# Altium schematic sheet Power_System.SchDoc
size A3; SheetNumber: 3; SheetTotal: 5
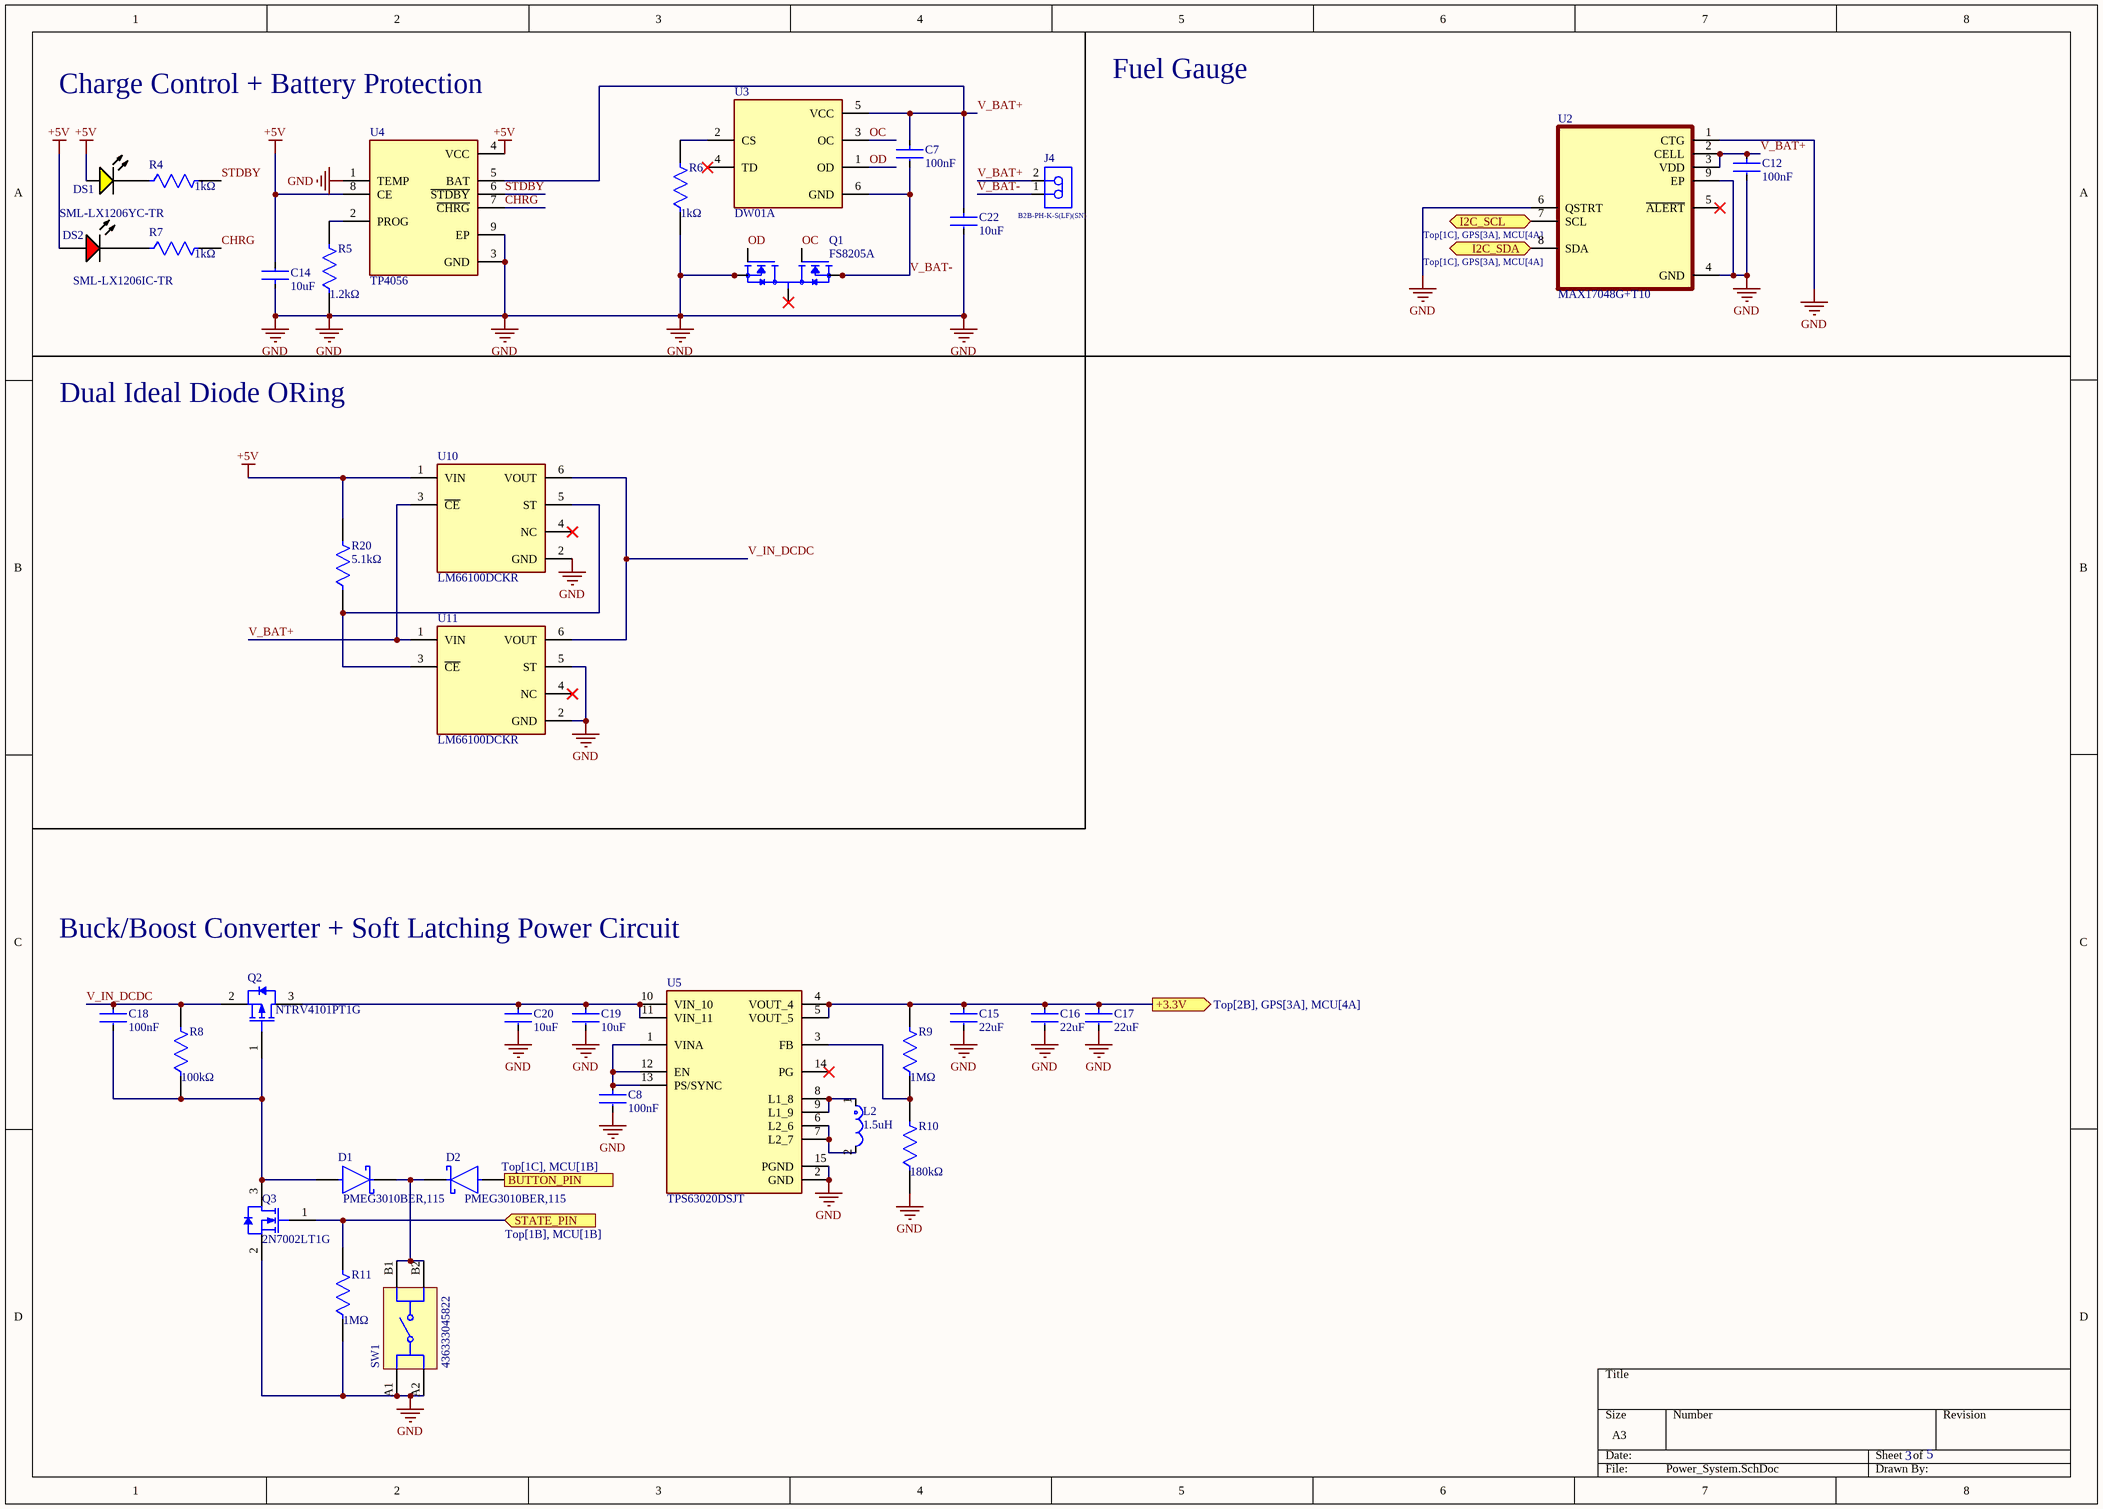
[diagram p0: Power_System.SchDoc]

## Parts
C7  100nF  [0402_CAPACITOR]
C8  100nF  [0402_CAPACITOR]
C12  100nF  [0603_CAPACITOR]
C14  10uF  [0402_CAPACITOR]
C15  22uF  [0603_CAPACITOR]
C16  22uF  [0603_CAPACITOR]
C17  22uF  [0603_CAPACITOR]
C18  100nF  [0603_CAPACITOR]
C19  10uF  [0603_CAPACITOR]
C20  10uF  [0603_CAPACITOR]
C22  10uF  [0402_CAPACITOR]
D1  PMEG3010BER,115  [SHOTTKY]
D2  PMEG3010BER,115  [SHOTTKY]
DS1  SML-LX1206YC-TR  [YELLOW_LED_1206]
DS2  SML-LX1206IC-TR  [RED_LED_1206]
J4  B2B-PH-K-S(LF)(SN)  [JST-B2B-PH-K-S_V]
L2  1.5uH  [1.5uH]
Q1  FS8205A  [SOP65P640X120-8N]
Q2  NTRV4101PT1G  [P_CHANNEL_MOSFET]
Q3  2N7002LT1G  [N_CHANNEL_MOSFET]
R4  value 1kΩ  [0402_RESISTOR]  (hidden comment: RESISTOR)
R5  value 1.2kΩ  [0402_RESISTOR]  (hidden comment: RESISTOR)
R6  value 1kΩ  [0402_RESISTOR]  (hidden comment: RESISTOR)
R7  value 1kΩ  [0402_RESISTOR]  (hidden comment: RESISTOR)
R8  value 100kΩ  [0603_RESISTOR]  (hidden comment: RESISTOR)
R9  value 1MΩ  [0603_RESISTOR]  (hidden comment: RESISTOR)
R10  value 180kΩ  [0603_RESISTOR]  (hidden comment: RESISTOR)
R11  value 1MΩ  [0603_RESISTOR]  (hidden comment: RESISTOR)
R20  value 5.1kΩ  [0603_RESISTOR]
SW1  436333045822  [SIDE_BUTTON]
U2  MAX17048G+T10  [MAX17048]
U3  DW01A  [SOT95P280X145-6N]
U4  TP4056  [SOP127P600X175-9N]
U5  TPS63020DSJT  [IC_TPS63020DSJT]
U10  LM66100DCKR  [ideal_diode]
U11  LM66100DCKR  [ideal_diode]

## Ports
+3.3V (out, see Top[2B], GPS[3A], MCU[4A]), BUTTON_PIN (out, see Top[1C], MCU[1B]), I2C_SCL (bidir, see Top[1C], GPS[3A], MCU[4A]), I2C_SDA (bidir, see Top[1C], GPS[3A], MCU[4A]), STATE_PIN (in, see Top[1B], MCU[1B])

## Nets
+5V: C14.2 DS1.1(A) DS2.1(A) R20.2 U4.4(VCC) U4.8(CE) U10.1(VIN)
GND: C8.2 C12.2 C14.1 C15.2 C16.2 C17.2 C19.2 C20.2 C22.2 Q1.2(S1) Q1.3(S1) Q3.2(S) R5.1 R6.1 R10.1 R11.1 SW1.A1 SW1.A2 U2.1(CTG) U2.4(GND) U2.6(QSTRT) U2.9(EP) U4.1(TEMP) U4.3(GND) U4.9(EP) U5.2(GND) U5.15(PGND) U10.2(GND) U11.2(GND) U11.5(ST)
+3.3V: C15.1 C16.1 C17.1 R9.2 U5.4(VOUT_4) U5.5(VOUT_5) ; port +3.3V
BUTTON_PIN: D2.2(A) ; port BUTTON_PIN
CHRG: R7.2 U4.7(~{CHRG})
I2C_SCL: U2.7(SCL) ; port I2C_SCL
I2C_SDA: U2.8(SDA) ; port I2C_SDA
OC: Q1.5(G2) U3.3(OC)
OD: Q1.4(G1) U3.1(OD)
STATE_PIN: Q3.1(G) R11.2 ; port STATE_PIN
STDBY: R4.2 U4.6(~{STDBY})
V_BAT+: C7.1 C12.1 C22.1 J4.2 U2.2(CELL) U2.3(VDD) U3.5(VCC) U4.5(BAT) U10.3(~{CE}) U11.1(VIN)
V_BAT-: C7.2 J4.1 Q1.6(S2) Q1.7(S2) U3.6(GND)
V_IN_DCDC: C18.1 Q2.2(S) R8.2 U10.6(VOUT) U11.6(VOUT)
NetC8_1: C8.1 U5.1(VINA) U5.12(EN) U5.13(PS/SYNC)
NetC18_2: C18.2 D1.2(A) Q2.1(G) Q3.3(D) R8.1
NetC19_1: C19.1 C20.1 Q2.3(D) U5.10(VIN_10) U5.11(VIN_11)
NetD1_1: D1.1(K) D2.1(K) SW1.B1 SW1.B2
NetDS1_2: DS1.2(K) R4.1
NetDS2_2: DS2.2(K) R7.1
NetL2_1: L2.1 U5.8(L1_8) U5.9(L1_9)
NetL2_2: L2.2 U5.6(L2_6) U5.7(L2_7)
NetQ1_1: Q1.1(D12) Q1.8(D12)
NetR5_2: R5.2 U4.2(PROG)
NetR6_2: R6.2 U3.2(CS)
NetR9_1: R9.1 R10.2 U5.3(FB)
NetR20_1: R20.1 U10.5(ST) U11.3(~{CE})

Not connected (* = marked no-connect by the designer): U2 5(~{ALERT})*; U3 4(TD)*; U5 14(PG)*; U10 4(NC)*; U11 4(NC)*

## Notes on the sheet
- Charge Control + Battery Protection
- Fuel Gauge
- Dual Ideal Diode ORing
- Buck/Boost Converter + Soft Latching Power Circuit

## Library data of the parts
C7 C8 C12 C14-C20 C22 = CMP-001-00091-1: Design Item ID: CAPACITOR; Source: gps_project_schematic_library.SchLib
D1 D2 = SHOTTKY: DIODE SCHOTTKY 30V 1A SOD123W; Manufacturer: Nexperia; Automotive Grade: Grade 0; Max Surge Forward Current: 50A; Peak Reverse Current: 15uA; Max Junction Temp: +150°C; Capacitance: 170pF; Value: 170pF; ComponentLink2URL: https://assets.nexperia.com/documents/data-sheet/PMEG3010BER.pdf; Reverse Voltage: 30V; Forward Current: 1A; Ambient Temperature Range Low: -55°C; Ambient Temperature Range High: +150°C; Octopart: https://octopart.com/pmeg3010ber%2C115-nexperia-78741454; Package: SOD123W; Category: Diode; Lead Free: Yes; Digikey Description: DIODE SCHOTTKY 30V 1A SOD123W; Automotive: Yes; RoHS: TRUE; Height: 1.1mm; Temperature: to +150°C; Device Class L2: Diodes; ComponentLink2Description: Datasheet; Manufacturer Part Number: PMEG3010BER,115; Temperature Range High: +150°C; Device Class L3: Schottky Diodes; Device Class L1: Discrete Semiconductors; Footprint Url: https://assets.nexperia.com/documents/outline-drawing/SOD123W.pdf
DS1 = YELLOW_LED_1206: Yellow LED, Water Clear Len, 585 nm, 2.1 V, -40 to 85 degC, 2-Pin SMD, RoHS, Tape and Reel; Manufacturer: Lumex; Product Training Modules: LEDsBenefitsofCustomLEDandLCDTechnology; Millicandela Rating: 6mcd; Catalog Drawings: SML-LX1206SeriesTopSML-LX1206SeriesSideSML-LX1206SeriesBottomSML-LX1206SeriesFootprint; Wavelength - Peak: 585nm; Other Names: 67-1358-2LU60357TRSMLLX1206YCTR; Lens Style/Size: RectanglewithFlatTop; Current - Test: 20mA; Lens Color: Colorless; Viewing Angle: 160°; Voltage - Forward (Vf) (Typ): 2.1V; Online Catalog: SML-LX1206RectanglewithFlatTop1206PackageLEDs; Mounting Type: SurfaceMount; Package Description: 2-Pin Surface Mount Device, Body 3.2 x 1.5 mm; Datasheet Version: Rev. K, 08/2012; Features: -; Color: Yellow; RoHS Information: RoHSCertofCompliance; Package Reference: SML-LX1206YC-TR; Supplier Device Package: 1206; Standard Package: 3,000; Series: -; Wavelength - Dominant: -; Package / Case: 1206(3216Metric); Mounting Technology: SurfaceMount; Height (Max): 1.10mm; Lens Transparency: Clear; Datasheet URL: http://www.lumex.com/content/files/ProductAttachment/SML-LX1206YC-TR.pdf; Family: LEDIndication-Discrete; Manufacturer URL: http://www.lumexinstruments.com/; Packaging: Tape&Reel(TR); Category: Optoelectronics; Size / Dimension: 3.20mmLx1.60mmW
DS2 = LED_RED_1206: LED Red, 65 mW, -40 to 85 degC, 2-Pin SMD, RoHS, Tape and Reel; Manufacturer: Lumex; LED Material: GaAsP; Peak Wavelength: 635nm; Number of LEDs: 1; Viewing Angle: 160; Reverse Voltage: 5(Min)V; Lens Appearance: ColorlessNonDiffused; Intensity: 6mcd; Type: Uni-Color; Pin_Count: 2; Lens Dimensions: 2x1.6x0.5mm; Mounting: SurfaceMount; ECCN: EAR99; RoHS: Unknown; Package Description: 2-Pin Surface Mount Device, Body 3.2 x 1.5 mm; Mounting Technology: SurfaceMount; Dominant Wavelength: N/A; Supplier_Package: SMD; Supplier Standard Pack: 3,000; Color: Red; Dimension: 3.2x1.6x1.1mm; HTS: 8541402000; Part No: SML-LX1206IC-TR; Family: SML-LX1206IC; Supplier: Lumex; Datasheet URL: http://www.lumex.com/content/files/ProductAttachment/SML-LX1206IC-TR.pdf; Package Reference: SML-LX1206IC; Manufacturer URL: http://www.lumexinstruments.com/; Operating Temperature: -25to85C; Packaging: TapeandReel; Datasheet Version: Rev. J, 08/2012
J4 = JST CONNECTOR: Male Header, Pitch 2 mm, 1 x 2 Position, Height 6 mm, Tail Length 3.4 mm, -25 to 85 degC, RoHS, Bulk; Manufacturer: JST; Pitch: 2mm; Style/Orientation: StraightHeader/Plug; No of Positions: 2; Datasheet Version: Nov-08; Datasheet URL: http://datasheet.octopart.com/B2B-PH-K-S%28LF%29%28SN%29-JST-datasheet-8324864.pdf; Manufacturer URL: http://www.jst.com/home2.html; Type: ShroudedHeader; Termination: Crimp
L2 = 1.5uH: Inductor Power Shielded Wirewound 1.5uH 20% 100KHz 9.1A 15.8mOhm DCR 1515 Automotive Embossed Plastic T/R; Core Material: Composite; DC Resistance (DCR): 15.8mR; Saturation Current: 4.1A; Self Resonant Frequency: 59MHz; Tolerance: 20%; Inductance: 1.5uH; Max DC Current: 9.1A; RoHS Compliant: Yes; Max Operating Temperature: 125°C; Length: 4.3mm; Case/Package: SMD/SMT; Mount: Surface Mount; Shielding: Shielded; Min Operating Temperature: -40°C; RMS Current (Irms): 9.1A; Test Frequency: 100kHz; Inductance Tolerance: 20%; REACH SVHC: No SVHC; Packaging: Tape and Reel; Termination: SMD/SMT; Lead Free: Contains Lead; Width: 4.3mm; Series: XFL4020; Height: 2.1mm
Q1 = FS8205A: MF: Fortune Semiconductor; SnapEDA_Link: https://www.snapeda.com/parts/FS8205A/Fortune+Semiconductor/view-part/?ref=snap; Package: Package; Value: *; MP: FS8205A; Check_prices: https://www.snapeda.com/parts/FS8205A/Fortune+Semiconductor/view-part/?ref=eda
Q2 = PMOS: Trench Power MOSFET, -20 V, Single P-Channel, 3-Pin SOT-23, Pb-Free, Tape and Reel; Manufacturer: On Semiconductor; Crss Typ (pF): 75; V(BR)DSS Min (V): 20; Coss Typ (pF): 100; Ciss Typ (pF): 675; VGS Max (V): 8; Channel Polarity: P Channel; ID Max (A): 3.2; VGS(th) Max (V): 1.2; Qrr Typ (nC): 1008; ComponentLink2URL: http://www.onsemi.cn/pub_link/Collateral/NTR4101P-D.PDF; PartNumber: NTRV4101PT1G; ComponentLink1Description: Manufacturer URL; Packing: Tape and Reel; ComponentLink1URL: http://www.onsemi.com/; PackageReference: SOT-23-3-318-08; ComponentLink3URL: http://www.onsemi.cn/pub_link/Collateral/318-08.PDF; PackageVersion: Rev. AP, 11/2009; Package Type: SOT-23-3; Configuration: Single; ComponentLink3Description: Package Specification; Mounting Technology: Surface Mount; RoHS: Pb-Free; ComponentLink2Description: Datasheet; PackageDescription: 3-Pin Small Outline Transistor, Body 2.92 x 1.3 mm, Pitch 0.95 mm; DatasheetVersion: Rev. 9
Q3 = NMOS: Small Signal MOSFET, 60 V, 115 mA, N-Channel, 3-Pin SOT-23, Pb-Free, Tape and Reel; Manufacturer: On Semiconductor; Channel Polarity: N Channel; V(BR)DSS Min (V): 60; ID Max (A): 0.115; VGS Max (V): 20; Configuration: Single; VGS(th) Max (V): 2.5; ComponentLink1URL: http://www.onsemi.com/; ComponentLink3Description: Package Specification; ComponentLink3URL: http://www.onsemi.cn/pub_link/Collateral/318-08.PDF; PackageReference: SOT-23-3-318-08; RoHS: Pb-Free; ComponentLink2URL: http://www.onsemi.com/pub_link/Collateral/2N7002L-D.PDF; ComponentLink1Description: Manufacturer URL; Package Type: SOT-23-3; Packing: Tape and Reel; PartNumber: 2N7002LT1G; DatasheetVersion: Rev. 7; Mounting Technology: Surface Mount; ComponentLink2Description: Datasheet; PackageDescription: 3-Pin Small Outline Transistor, Body 2.92 x 1.3 mm, Pitch 0.95 mm; PackageVersion: Rev. AP, 11/2009
R20 = RESISTOR
SW1 = SIDE_BUTTON: Tactile Switch, WS-TASU Series, Side Actuated, SMD, Rectangular Button; Voltage Rating: 12V; Operating Force: 220N; Contact Resistance: 100mΩ; Current Rating: 50mA; Packaging: Tape and Reel; Contact Plating: Silver; Width: 4.7mm; Min Operating Temperature: -40°C; Insulation Resistance: 100MΩ; Height: 1.65mm; Contact Current Rating: 50mA; Max Operating Temperature: 85°C; RoHS: Compliant
U2 = MAX17048G+T10: 3ÂµA 1-Cell/2-Cell Fuel Gauge with ModelGauge; MF: Analog Devices; Package: TDFN-8 Maxim; Price: None; Check_prices: https://www.snapeda.com/parts/MAX17048G+T10/Analog+Devices/view-part/?ref=eda; Value: *; SnapEDA_Link: https://www.snapeda.com/parts/MAX17048G+T10/Analog+Devices/view-part/?ref=snap; MP: MAX17048G+T10; Availability: In Stock; Purchase-URL: https://pricing.snapeda.com/search/part/MAX17048G+T10/?ref=eda
U3 = DW01A: One Cell Lithium-ion/Polymer Battery Protection IC; MF: Fortune Semiconductor; SnapEDA_Link: https://www.snapeda.com/parts/DW01A/Fortune+Semiconductor/view-part/?ref=snap; Package: SOT-23-6 Fortune Semiconductor; Value: *; MP: DW01A; Check_prices: https://www.snapeda.com/parts/DW01A/Fortune+Semiconductor/view-part/?ref=eda
U4 = TP4056: Complete single cell Li-Ion battery with a constant current / constant voltage linear charger; MF: NanJing Top Power ASIC Corp.; Check_prices: https://www.snapeda.com/parts/TP4056/NanJing+Top+Power+ASIC+Corp./view-part/?ref=eda; SnapEDA_Link: https://www.snapeda.com/parts/TP4056/NanJing+Top+Power+ASIC+Corp./view-part/?ref=snap; Price: None; Availability: Not in stock; Package: Package; MP: TP4056; Value: *
U5 = TPS63020DSJT: High Efficiency Single Inductor Buck-Boost Converter with 4A Switch; MF: Texas Instruments; SnapEDA_Link: https://www.snapeda.com/parts/TPS63020DSJT/Texas+Instruments/view-part/?ref=snap; Package: VSON-14 Texas Instruments; Value: *; MP: TPS63020DSJT; Check_prices: https://www.snapeda.com/parts/TPS63020DSJT/Texas+Instruments/view-part/?ref=eda
U10 U11 = LM66100DCKR: 1.5-V to 5.5-V, 1.5-A, 0.5-ÂµA IQ ideal diode with integrated FET; MF: Texas Instruments; SnapEDA_Link: https://www.snapeda.com/parts/LM66100DCKR/Texas+Instruments/view-part/?ref=snap; Package: SOT-SC70-6 Texas Instruments; Value: *; MP: LM66100DCKR; Check_prices: https://www.snapeda.com/parts/LM66100DCKR/Texas+Instruments/view-part/?ref=eda